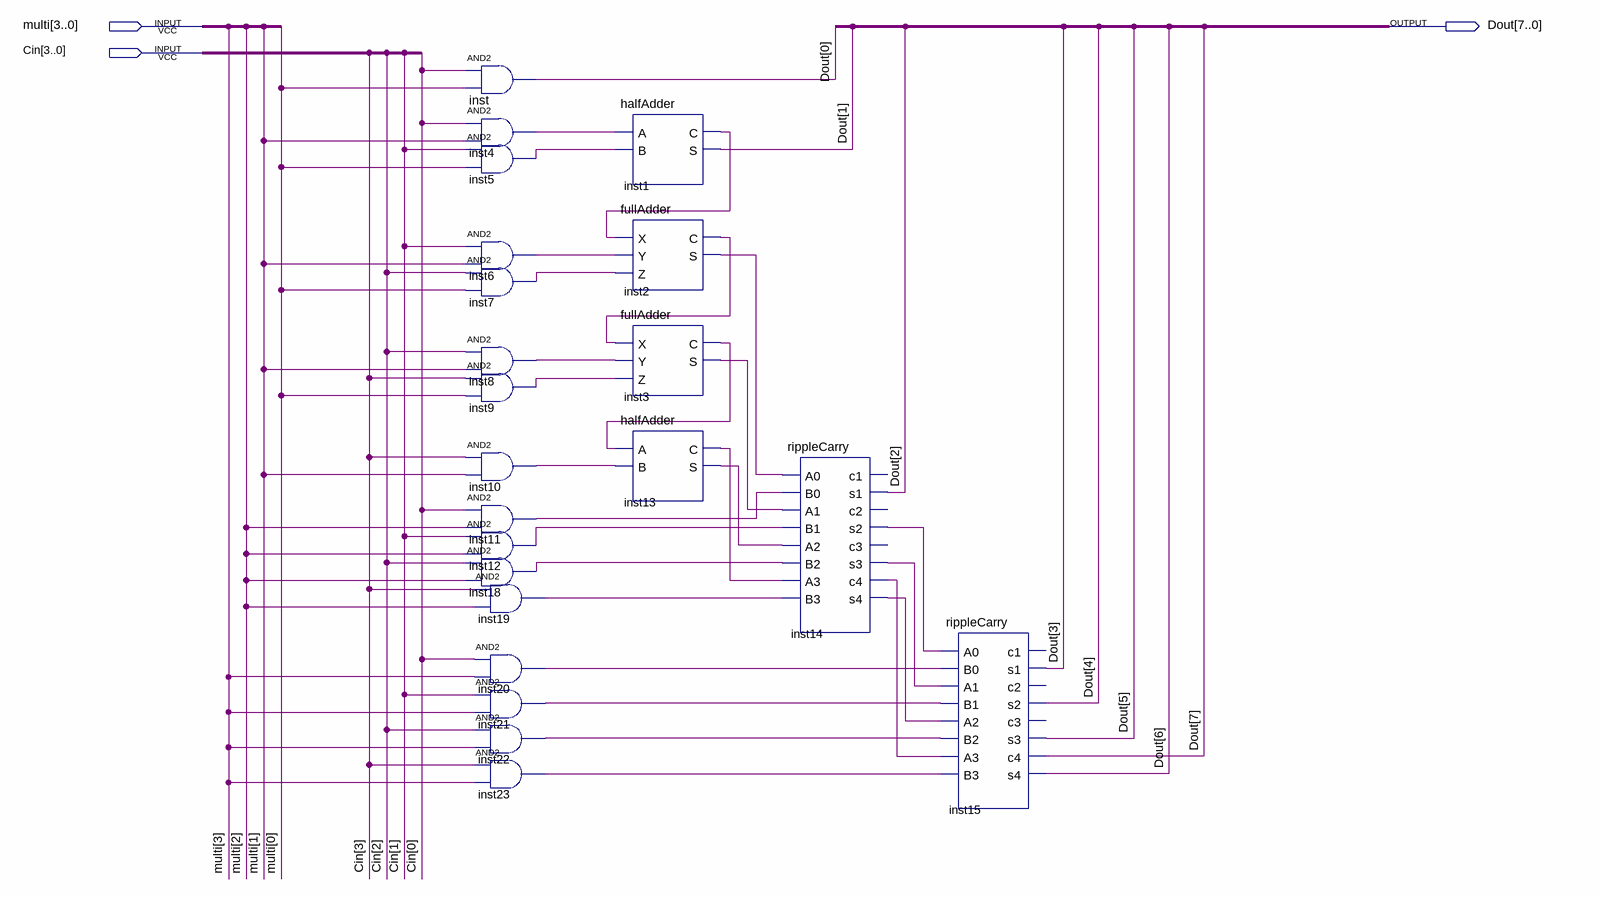
[diagram p0: schematic sheet]
// Quartus schematic multiFourbit.bdf as structural Verilog: 22 symbols, 3 pins
module multiFourbit (
  input  [3:0] multi,
  input  [3:0] Cin,
  output [7:0] Dout
);

  wire inst1_c, inst2_c, inst2_s, inst3_c, inst3_s, inst4_out, inst5_out, inst6_out, inst7_out, inst8_out,
       inst9_out, inst10_out, inst11_out, inst12_out, inst13_c, inst13_s, inst14_c4, inst14_s2, inst14_s3,
       inst14_s4, inst18_out, inst19_out, inst20_out, inst21_out, inst22_out, inst23_out;

  and inst (Dout[0], Cin[0], multi[0]);
  and inst4 (inst4_out, Cin[0], multi[1]);
  and inst5 (inst5_out, Cin[1], multi[0]);
  and inst6 (inst6_out, Cin[1], multi[1]);
  and inst7 (inst7_out, Cin[2], multi[0]);
  and inst8 (inst8_out, Cin[2], multi[1]);
  and inst9 (inst9_out, Cin[3], multi[0]);
  and inst10 (inst10_out, Cin[3], multi[1]);
  and inst11 (inst11_out, Cin[0], multi[2]);
  and inst12 (inst12_out, Cin[1], multi[2]);
  and inst18 (inst18_out, Cin[2], multi[2]);
  and inst19 (inst19_out, Cin[3], multi[2]);
  and inst20 (inst20_out, Cin[0], multi[3]);
  and inst21 (inst21_out, Cin[1], multi[3]);
  and inst22 (inst22_out, Cin[2], multi[3]);
  and inst23 (inst23_out, Cin[3], multi[3]);
  halfAdder inst1 (.A(inst4_out), .B(inst5_out), .C(inst1_c), .S(Dout[1]));
  fullAdder inst2 (.X(inst1_c), .Y(inst6_out), .Z(inst7_out), .C(inst2_c), .S(inst2_s));
  fullAdder inst3 (.X(inst2_c), .Y(inst8_out), .Z(inst9_out), .C(inst3_c), .S(inst3_s));
  halfAdder inst13 (.A(inst3_c), .B(inst10_out), .C(inst13_c), .S(inst13_s));
  rippleCarry inst14 (
    .A0(inst2_s), .B0(inst11_out), .A1(inst3_s), .B1(inst12_out), .A2(inst13_s), .B2(inst18_out),
    .A3(inst13_c), .B3(inst19_out), .s1(Dout[2]), .s2(inst14_s2), .s3(inst14_s3), .c4(inst14_c4),
    .s4(inst14_s4));  // open: c1, c2, c3
  rippleCarry inst15 (
    .A0(inst14_s2), .B0(inst20_out), .A1(inst14_s3), .B1(inst21_out), .A2(inst14_s4), .B2(inst22_out),
    .A3(inst14_c4), .B3(inst23_out), .s1(Dout[3]), .s2(Dout[4]), .s3(Dout[5]), .c4(Dout[7]), .s4(Dout[6]));  // open: c1, c2, c3
endmodule
